# Altium project Steering_IO.PrjPcb
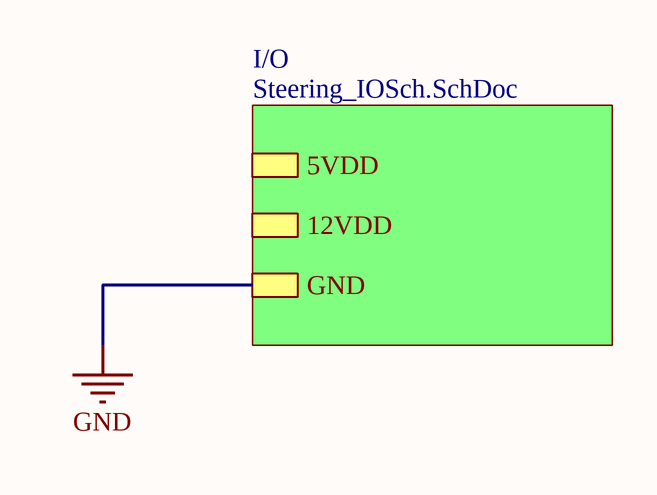
[diagram p0: TopLevel.SchDoc]
2 sheets, 6 parts. Net scope: hierarchical (ports join the sheet entries above them; power ports are global).
Board file: Steering_IOPCB.PcbDoc
Sheets:
  TopLevel.SchDoc
    I/O = Steering_IOSch.SchDoc

## Sheet TopLevel.SchDoc
size A; SheetNumber: 1; SheetTotal: 2

### Sub-sheets
I/O = Steering_IOSch.SchDoc: 5VDD, 12VDD, GND

### Nets
GND: sheet I/O/GND

## Sheet Steering_IOSch.SchDoc
size A; SheetNumber: 2; SheetTotal: 2
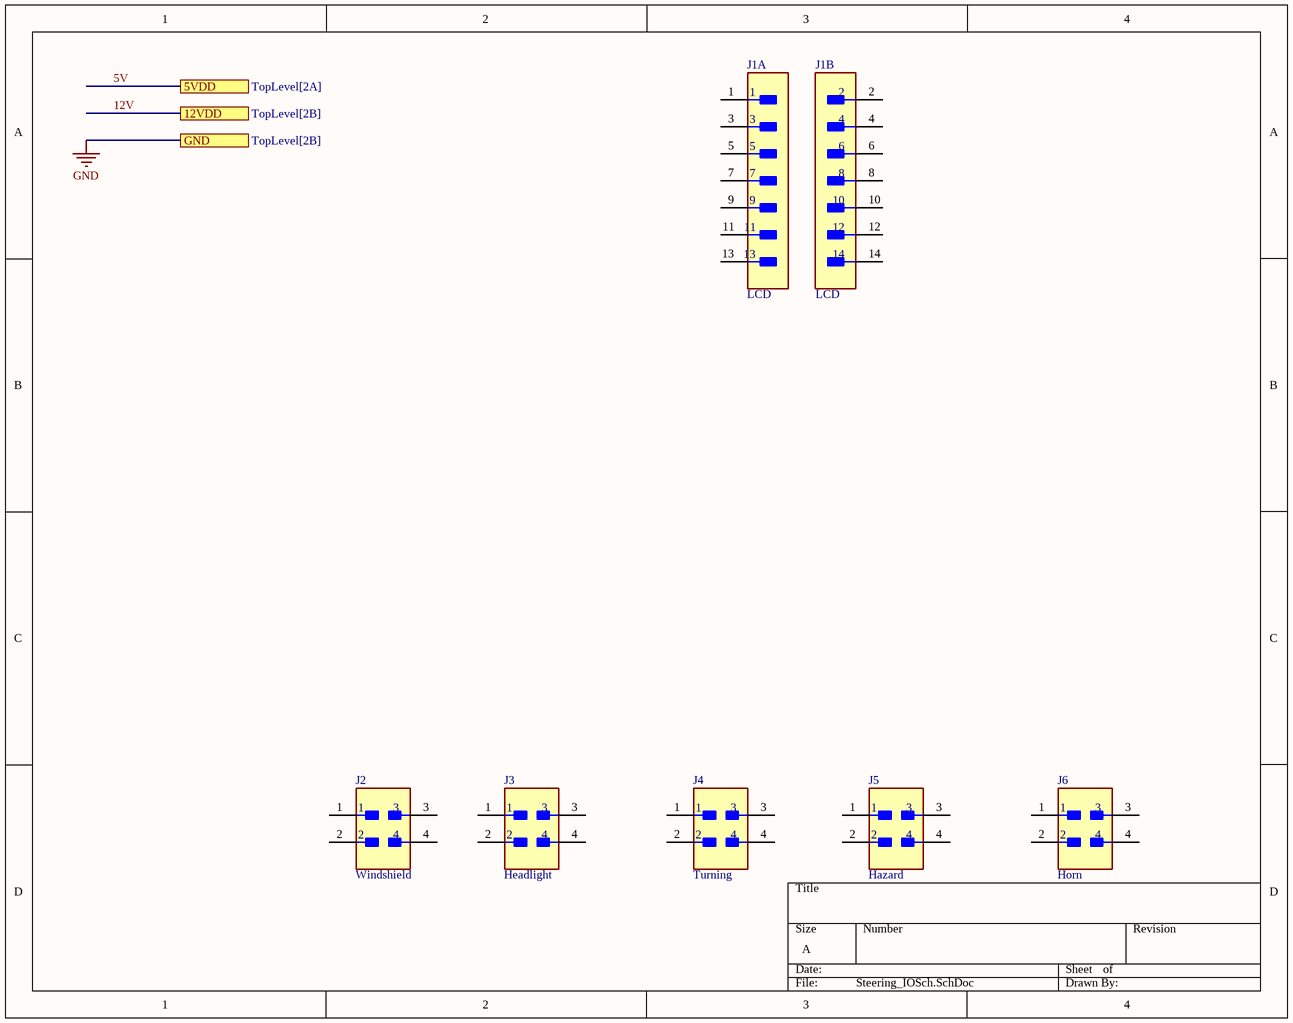
[diagram p1: Steering_IOSch.SchDoc]

### Parts
J1  LCD  [FP-39-28-1143-MFG]  (parts A,B of 2)
J2  Windshield  [FP-0039281043-MFG]
J3  Headlight  [FP-0039281043-MFG]
J4  Turning  [FP-0039281043-MFG]
J5  Hazard  [FP-0039281043-MFG]
J6  Horn  [FP-0039281043-MFG]

### Ports
5VDD (see TopLevel[2A]), 12VDD (see TopLevel[2B]), GND (see TopLevel[2B])

### Nets

Not connected (* = marked no-connect by the designer): J1 1 2 3 4 5 6 7 8 9 10 11 12 13 14; J2 1 2 3 4; J3 1 2 3 4; J4 1 2 3 4; J5 1 2 3 4; J6 1 2 3 4

### Library data of the parts
J1 = CMP-04776-000277-1: CONN HEADER VERT 14POS 4.2MM; Mating Cycles: 30; Voltage Rating (DC): 600V; Max Voltage Rating (DC): 600.6kV; Insulation Resistance: 1GR; Number of Positions: 14; Max Current Rating: 3A; Current Rating: 6A; Test Voltage: 1.5kV; Approvals: UL; Number of Lines: 2; Glow Wire Compliant: Non-compliant; Gender: Male; Row Spacing: 5.5mm; Connector Type: Power; Contact Resistance: 10mR; Package Quantity: 150; Packaging: Bulk; Height: 8.13mm; Voltage Rating: 600V; Series: 5566; Max Operating Temperature: 105°C; Pitch: 4.2mm; Orientation: Straight; Contact Plating: Tin; Length: 101.19mm; Radiation Hardening: No; Voltage Rating (AC): 600V; Material: Nylon; Number of Circuits: 14; Termination: Solder; Halogen Free: Low Halogen; Contact Gender: Male; Min Operating Temperature: -40°C; Number of Poles: 14; Number of Contacts: 14; Color: Natural; RoHS Compliant: Yes; Depth: 2.34mm; Housing Material: Nylon; Mount: Through Hole; Housing Color: Black; Working Voltage: 600V; Lead Free: Lead Free; Number of Rows: 2; Contact Material: Brass; Flammability Rating: UL94 V-0
J2-J6 = 1x4_FEMALE_POWER: CONN HEADER VERT 4POS 4.2MM. 0039281043; Manufacturer: Molex; Conn Orientation: Vertical; Conn Gender: Male; Current Rating: 9A; Voltage Rating: 600V; Number Of Contacts: 4; Pitch: 4.2mm; Manufacturer Part Number: 0039281043; Lead Free: Yes; Category: Conn; Height: 13.1mm; ComponentLink2URL: https://www.molex.com/webdocs/datasheets/pdf/en-us/0039281043_PCB_HEADERS.pdf; Package: 0; Device Class L2: Headers and Wire Housings; Contact Material: Tin; Footprint Url: https://www.molex.com/pdm_docs/sd/039281043_sd.pdf; Device Class L1: Connectors; Temperature Range High: +105°C; Automotive: No; RoHS: TRUE; Temperature: -40°C to +105°C; Number Of Rows: 2; Digikey Description: CONN HEADER VERT 4POS 4.2MM; Temperature Range Low: -40°C; Octopart: https://octopart.com/39-28-1043-molex-7613; Device Class L3: unset; ComponentLink2Description: Datasheet